# EAGLE design G17_Sensor_V2 (EAGLE 9.6.2)

## Sheet 1 of 4
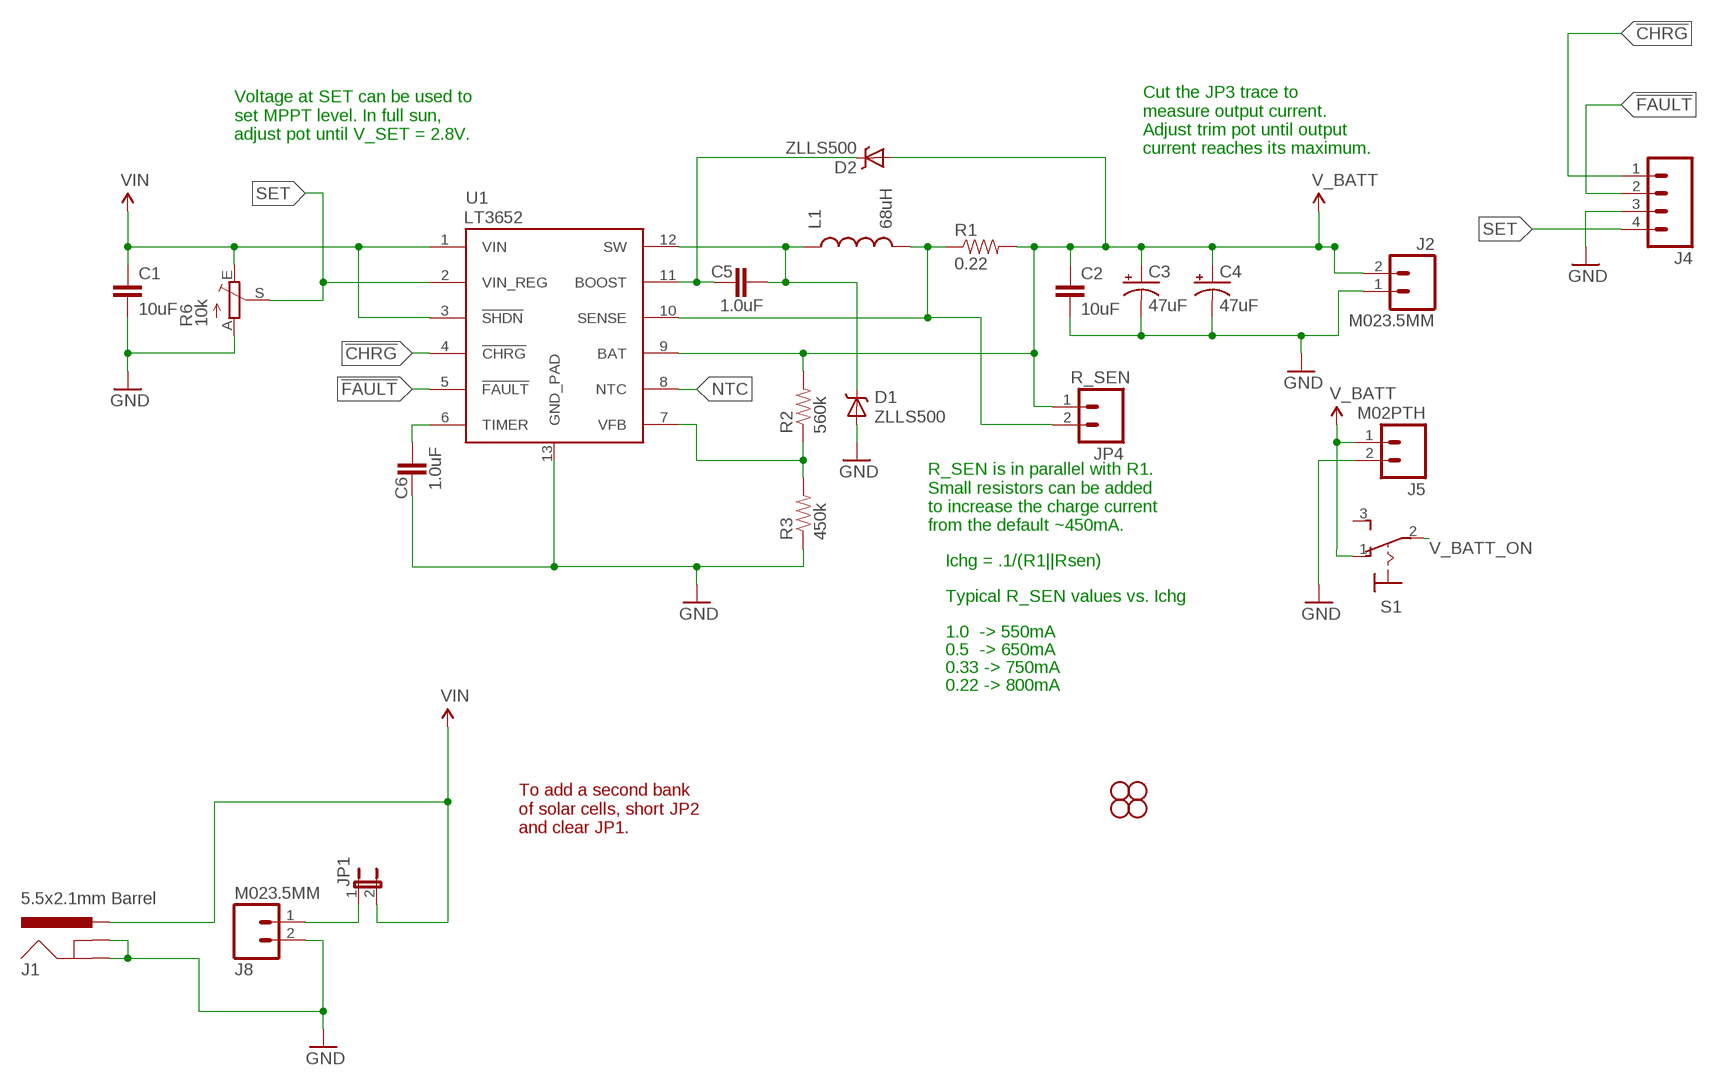
[diagram p0: schematic, sheet 1]

### Parts
C1  10uF  10UF50V20%(1210)  [1210]
C2  10uF  10UF-6.3V-20%(1206)  [1206]
C3  47uF  47UF-TANT  [EIA3528]
C4  47uF  47UF-TANT  [EIA3528]
C5  1.0uF  1.0UF-16V-10%(0603)  [0603-CAP]
C6  1.0uF  1.0UF-16V-10%(0603)  [0603-CAP]
D1  ZLLS500  ZLLS500ZLLS500  [SOT23]
D2  ZLLS500  ZLLS500ZLLS500  [SOT23]
J1  5.5x2.1mm Barrel  POWER_JACKSMD  [POWER_JACK_SMD]
J2  M023.5MM  [SCREWTERMINAL-3.5MM-2]
J4  M04PTH  [1X04]
J5  M02PTH  [1X02]
J8  M023.5MM  [SCREWTERMINAL-3.5MM-2]
JP1  JUMPER-2SMD-NC  [SJ_2S]
JP4  R_SEN  M02PTH  [1X02]
L1  68uH  INDUCTOR68UH-1A  [CR75]
R1  0.22  0.22OHM1/4W1%(0805)  [0805]
R2  560k  47KOHM1/10W1%(0603)  [0603-RES]
R3  450k  220KOHM1/10W1%(0603)  [0603-RES]
R6  10k  TRIM_EU-S63S  [S63S]
S1  M9040P  [M9040P]
STANDOFF1  STAND-OFF  [STAND-OFF]
STANDOFF2  STAND-OFF  [STAND-OFF]
STANDOFF3  STAND-OFF  [STAND-OFF]
STANDOFF4  STAND-OFF  [STAND-OFF]
U1  LT3652  [MSOP-12_GND]

### Nets
!CHRG: J4.1 U1.4(!CHRG)
!FAULT: J4.2 U1.5(!FAULT)
BOOST: C5.1 D2.3(C) U1.11(BOOST)
FB: R2.1 R3.2 U1.7(VFB)
GND: C1.2 C2.2 C3.C(-) C4.C(-) C6.1 D1.1(A) J1.GND(GNDBREAK) J1.P$4(GND) J2.1 J4.3 J5.2 J8.2 R3.1 R6.A U1.13(GND_PAD) ; also sheet 2
N$8: J8.1 JP1.1
NTC: U1.8(NTC)
SENSE: JP4.2 L1.P$2 R1.1 U1.10(SENSE)
SET: J4.4 R6.S U1.2(VIN_REG)
SW: C5.2 D1.3(C) L1.P$1 U1.12(SW)
TIMER: C6.2 U1.6(TIMER)
V_BATT: C2.1 C3.A(+) C4.A(+) D2.1(A) J2.2 J5.1 JP4.1 R1.2 R2.2 S1.1(O) U1.9(BAT)
V_BATT_ON: S1.2(P) ; also sheet 2
VIN: C1.1 J1.VIN0(PWR) JP1.2 R6.E U1.1(VIN) U1.3(!SHDN)
Unconnected: S1.3(S)

### Notes on the sheet
- Voltage at SET can be used to
  set MPPT level. In full sun,
  adjust pot until V_SET = 2.8V.
- Cut the JP3 trace to
  measure output current.
  Adjust trim pot until output
  current reaches its maximum.
- R_SEN is in parallel with R1.
  Small resistors can be added
  to increase the charge current
  from the default ~450mA.
- Ichg = .1/(R1||Rsen)
- Typical R_SEN values vs. Ichg
- 1.0  -> 550mA
- 0.5  -> 650mA
- 0.33 -> 750mA
- 0.22 -> 800mA
- To add a second bank
  of solar cells, short JP2
  and clear JP1.

## Sheet 2 of 4
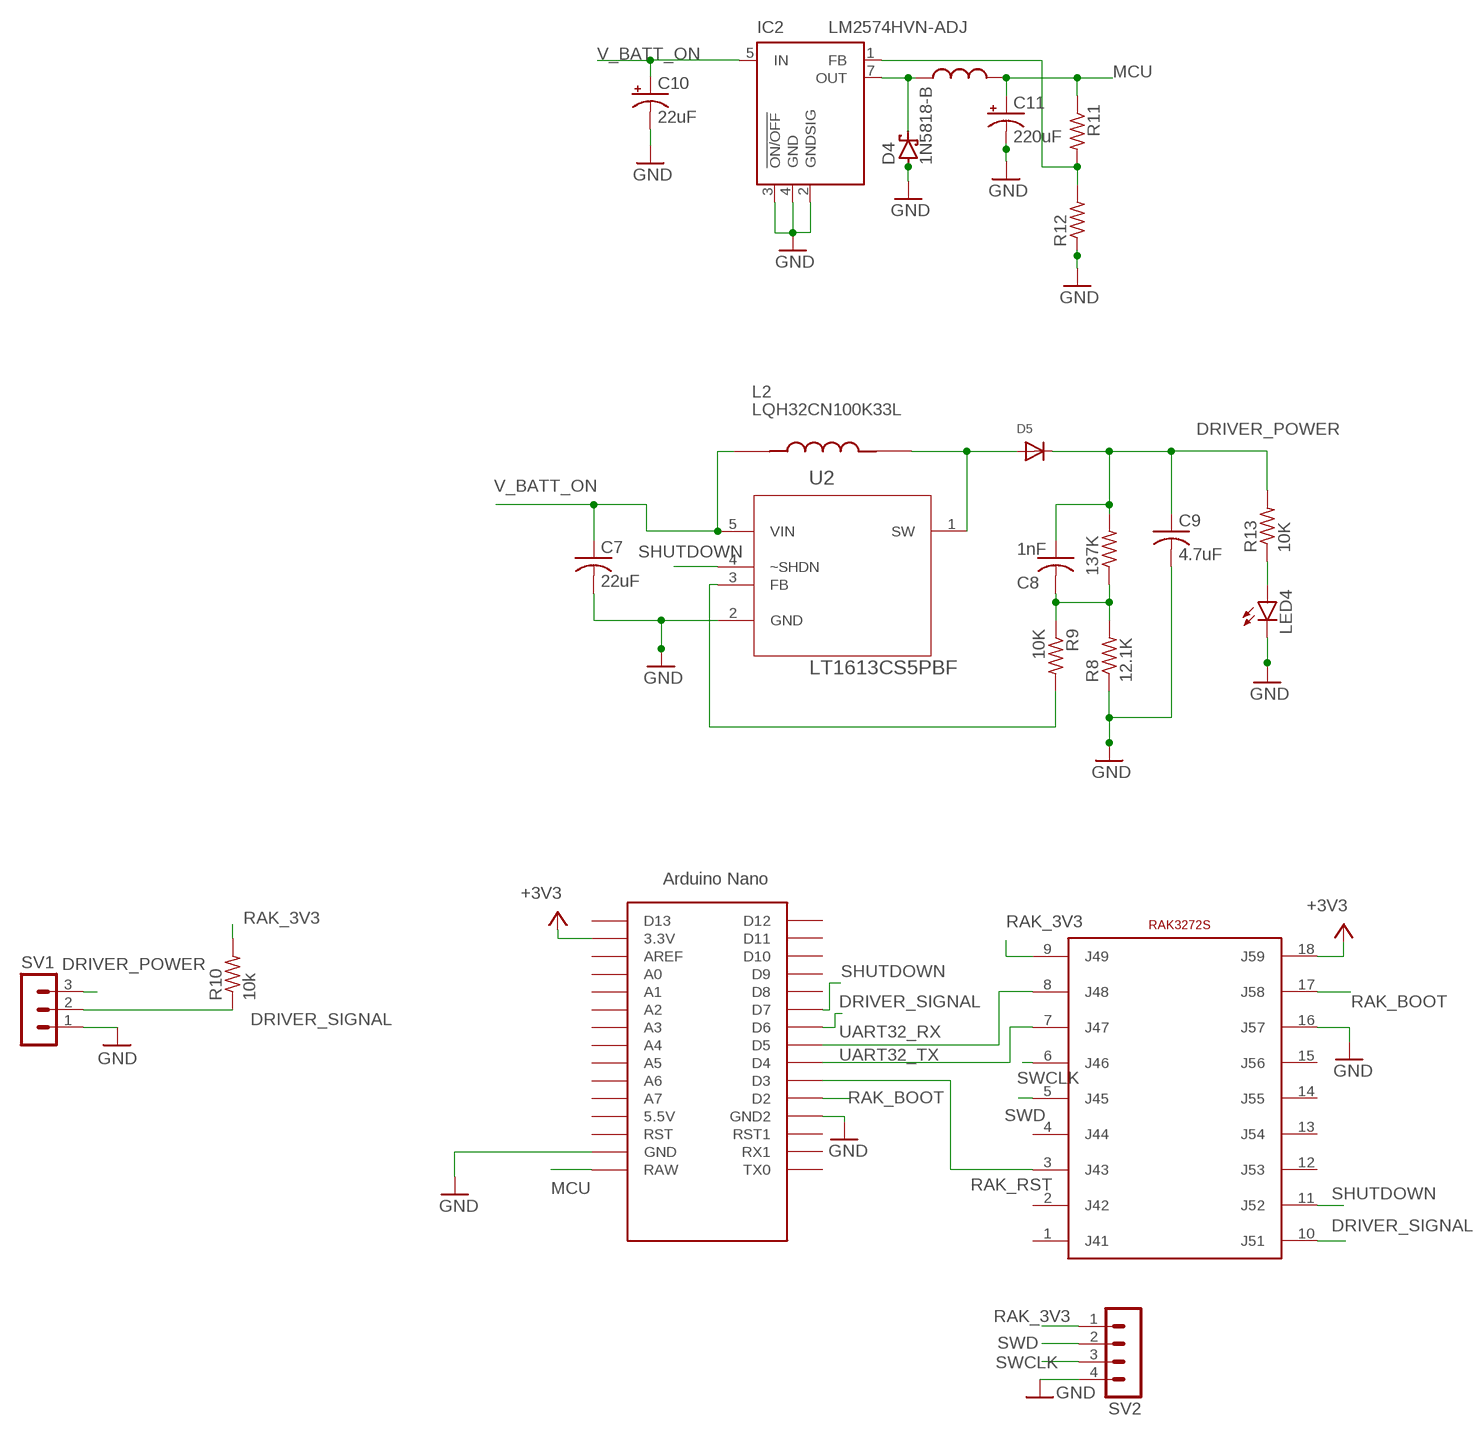
[diagram p1: schematic, sheet 2]

### Parts
137K  R-US_R0805  [R0805]
C7  22uF  C-USC0805  [C0805]
C8  1nF  C-USC0805  [C0805]
C9  4.7uF  C-USC1206  [C1206]
C10  22uF  CPOL-USE5-6  [E5-6]
C11  220uF  CPOL-USE5-6  [E5-6]
D4  1N5818-B  [DO41-7.6]
D5  DIODESOD-123  [SOD-123]
IC2  LM2574HVN-ADJ  [DIL08]
L2  LQH32CN100K33L  [IND_LQH32CN100K33L]
LED4  LED5MM  [LED5MM]
R8  12.1K  R-US_R1206  [R1206]
R9  10K  R-US_R0805  [R0805]
R10  10k  R-US_0204/5  [0204/5]
R11  R-US_0204/7  [0204/7]
R12  R-US_0204/7  [0204/7]
R13  10K  R-US_R0805  [R0805]
SV1  MA03-1  [MA03-1]
SV2  MA04-1  [MA04-1]
U2  LT1613CS5PBF  [SOT95P280X145-5N]
U$1  330UH_INDUCTOR  [330UH_INDUCTOR]
U$3  NANO  [NANO]
U$4  RAK3272S  [RAK3272SFOOTPRINT]

### Nets
+3V3: U$3.3.3V U$4.18(J59)
DRIVER_POWER: 137K.2 C8.1 C9.1 D5.C R13.2 SV1.3
DRIVER_SIGNAL: R10.1 SV1.2 U$3.D6 U$4.10(J51)
GND: C7.2 C9.2 C10.- C11.- D4.A IC2.2(GNDSIG) IC2.3(!ON/OFF) IC2.4(GND) LED4.K(C) R8.1 R12.1 SV1.1 SV2.4 U2.2(GND) U$3.GND U$3.GND1(GND2) U$4.16(J57) ; also sheet 1
MCU: C11.+ R11.1 U$1.P$2 U$3.RAW
N$5: IC2.1(FB) R11.2 R12.2
N$7: R9.2 U2.3(FB)
N$9: D5.A L2.2 U2.1(SW)
N$10: D4.C IC2.7(OUT) U$1.P$1
N$11: 137K.1 C8.2 R8.2 R9.1
N$12: LED4.A R13.1
RAK_3V3: R10.2 SV2.1 U$4.9(J49)
RAK_BOOT: U$3.D2 U$4.17(J58)
RAK_RST: U$3.D3 U$4.3(J43)
SHUTDOWN: U2.4(~SHDN) U$3.D7 U$4.11(J52)
SWCLK: SV2.3 U$4.6(J46)
SWD: SV2.2 U$4.5(J45)
UART32_RX: U$3.D5 U$4.8(J48)
UART32_TX: U$3.D4 U$4.7(J47)
V_BATT_ON: C7.1 C10.+ IC2.5(IN) L2.1 U2.5(VIN) ; also sheet 1
Unconnected: U$3.5V(5.5V) U$3.A0 U$3.A1 U$3.A2 U$3.A3 U$3.A4 U$3.A5 U$3.A6 U$3.A7 U$3.AREF U$3.D8 U$3.D9 U$3.D10 U$3.D11 U$3.D12 U$3.D13 U$3.ICSP1 U$3.ICSP2 U$3.ICSP3 U$3.ICSP4 U$3.ICSP5 U$3.ICSP6 U$3.RST U$3.RST1 U$3.RX1 U$3.TX0 U$4.1(J41) U$4.2(J42) U$4.4(J44) U$4.12(J53) U$4.13(J54) U$4.14(J55) U$4.15(J56)

## Sheet 3 of 4

## Sheet 4 of 4

## Library data of the parts
137K R8-R13 = rcl:R-US_: RESISTOR, American symbol; SPICEPREFIX: R
C1 = SparkFun-Capacitors:10UF50V20%(1210): CAP-09824; PROD_ID: CAP-09824
C2 = SparkFun-Capacitors:10UF-6.3V-20%(1206): Ceramic CAP-10057; PROD_ID: CAP-10057
C3 C4 = SparkFun-Capacitors:47UF-TANT: 47uF Tantalum SMT CAP-08310- 10V 10% (EIA-3528); PROD_ID: CAP-08310
C5 C6 = SparkFun-Capacitors:1.0UF-16V-10%(0603): CAP-00868; PROD_ID: CAP-00868
C7-C9 = rcl:C-US: CAPACITOR, American symbol; SPICEPREFIX: C
C10 C11 = rcl:CPOL-US: POLARIZED CAPACITOR, American symbol; SPICEPREFIX: C
D1 D2 = SparkFun-DiscreteSemi:ZLLS500: 700mA 40V SOT-23 Schottky; PROD_ID: DIO-08411
D4 = diode:1N581*: 1.0A SCHOTTKY BARRIER RECTIFIER Source: http://www.diodes.com/datasheets/ds23001.pdf
D5 = adafruit:DIODE: Diode SMADIODE - SMA Surface Mount Package 20V 1A Schottky Diode Digikey: 641-1014-6-ND DO-1N4148 - Through Hole Small Current Diode SOD-123 20V 1 A (.5mV Vf) Schottky Diode - Digikey: MBRX120TPMSCT-ND SOD-323 10V 570mA (.38mV Vf, 3ns) Schottky Diode - Digikey: ZLLS410CT-ND SOD-523 30V 30mA Schottky Diode (RB751S-40TE61) - Digikey: RB751S-40TE61CT-ND SOT23-R/W - SOT23 Package (R = Solder Paste/Reflow Ovens, W = Hand-Soldering) BAT54Film 40V 300mA - Digikey: 497-7162-1-ND
IC2 = linear:LM2574?-*: SIMPLE SWITCHER 0.5A Step-Down Voltage Regulator Source: http://cache.national.com/ds/LM/LM2574.pdf
J1 = SparkFun-Connectors:POWER_JACK: Power Jack This is the standard 5.5mm barrel jack for power. The PTH is the most common, proven, reliable, footprint. The Slot footprint only works if the mill layer is transmitted to the PCB fab house so be warned. Spark Fun Electronics SKU : PRT-00119 SMT: CONN-08106 Mating wall wart : TOL-00298 (and others); PROD_ID: CONN-08106
J2 J5 J8 JP4 = SparkFun-Connectors:M02: Standard 2-pin 0.1" header. Use with - straight break away headers ( PRT-00116) - right angle break away headers (PRT-00553) - swiss pins (PRT-00743) - machine pins (PRT-00117) - female headers (PRT-00115) Molex polarized connector foot print use with: PRT-08233 with associated crimp pins and housings. 2.54_SCREWTERM for use with PRT-10571. 3.5mm Screw Terminal footprints for PRT-08084 5mm Screw Terminal footprints for use with PRT-08433
J4 = SparkFun-Connectors:M04: Header 4 Standard 4-pin 0.1" header. Use with straight break away headers (SKU : PRT-00116), right angle break away headers (PRT-00553), swiss pins (PRT-00743), machine pins (PRT-00117), and female headers (PRT-00115). Molex polarized connector foot print use with SKU : PRT-08231 with associated crimp pins and housings. 1MM SMD Version SKU: PRT-10208
JP1 = SparkFun-Passives:JUMPER-2: Jumper Basic 0.1" spaced jumper. Use with breakaway headers.
L1 = SparkFun-Passives:INDUCTOR: Inductors Basic Inductor/Choke - 0603 and 1206. Footprints are not proven and vary greatly between part numbers. SRN6045- 33uH, 20% 1.4A SDR0403-560KL - 56uH, 10%, 500mA RMS/740mA peak; PROD_ID: NDUC-09739
L2 = LQH32CN100K33L:LQH32CN100K33L: Wire Wound Ferrite Inductor for Power Lines For Automotive Check availability <https://pricing.snapeda.com/parts/LQH32CN100K33L/Murata/view-part?ref=eda>; AVAILABILITY: In Stock; DESCRIPTION: Inductor with Inductance: 10uH Tol. +/-10%, Package: 1210 (3225); MF: Murata; MP: LQH32CN100K33L; PACKAGE: 1210-2 Murata; PRICE: None; PURCHASE-URL: https://pricing.snapeda.com/search/part/LQH32CN100K33L/?ref=eda
LED4 = led:LED: LED OSRAM: - CHIPLED LG R971, LG N971, LY N971, LG Q971, LY Q971, LO R971, LY R971 LH N974, LH R974 LS Q976, LO Q976, LY Q976 LO Q996 - Hyper CHIPLED LW Q18S LB Q993, LB Q99A, LB R99A - SideLED LS A670, LO A670, LY A670, LG A670, LP A670 LB A673, LV A673, LT A673, LW A673 LH A674 LY A675 LS A676, LA A676, LO A676, LY A676, LW A676 LS A679, LY A679, LG A679 - Hyper Micro SIDELED® LS Y876, LA Y876, LO Y876, LY Y876 LT Y87S - SmartLED LW L88C, LW L88S LB L89C, LB L89S, LG L890 LS L89K, LO L89K, LY L89K LS L896, LA L896, LO L896, LY L896 - TOPLED LS T670, LO T670, LY T670, LG T670, LP T670 LSG T670, LSP T670, LSY T670, LOP T670, LYG T670 LG T671, LOG T671, LSG T671 LB T673, LV T673, LT T673, LW T673 LH T674 LS T676, LA T676, LO T676, LY T676, LB T676, LH T676, LSB T676, LW T676 LB T67C, LV T67C, LT T67C, LS T67K, LO T67K, LY T67K, LW E67C LS E67B, LA E67B, LO E67B, LY E67B, LB E67C, LV E67C, LT E67C LW T67C LS T679, LY T679, LG T679 LS T770, LO T770, LY T770, LG T770, LP T770 LB T773, LV T773, LT T773, LW T773 LH T774 LS E675, LA E675, LY E675, LS T675 LS T776, LA T776, LO T776, LY T776, LB T776 LHGB T686 LT T68C, LB T68C - Hyper Mini TOPLED® LB M676 - Mini TOPLED Santana® LG M470 LS M47K, LO M47K, LY M47K Source: http://www.osram.convergy.de LUXEON: - LUMILED® LXK2-PW12-R00, LXK2-PW12-S00, LXK2-PW14-U00, LXK2-PW14-V00 LXK2-PM12-R00, LXK2-PM12-S00, LXK2-PM14-U00 LXK2-PE12-Q00, LXK2-PE12-R00, LXK2-PE12-S00, LXK2-PE14-T00, LXK2-PE14-U00 LXK2-PB12-K00, LXK2-PB12-L00, LXK2-PB12-M00, LXK2-PB14-N00, LXK2-PB14-P00, LXK2-PB14-Q00 LXK2-PR12-L00, LXK2-PR12-M00, LXK2-PR14-Q00, LXK2-PR14-R00 LXK2-PD12-Q00, LXK2-PD12-R00, LXK2-PD12-S00 LXK2-PH12-R00, LXK2-PH12-S00 LXK2-PL12-P00, LXK2-PL12-Q00, LXK2-PL12-R00 Source: www.luxeon.com KINGBRIGHT: KA-3528ASYC Source: www.kingbright.com
R1 = SparkFun-Resistors:0.22OHM1/4W1%(0805): RES-09883; PROD_ID: RES-09883
R2 = SparkFun-Resistors:47KOHM1/10W1%(0603): RES-07871; PROD_ID: RES-07871; VALUE: 47K
R3 = SparkFun-Resistors:220KOHM1/10W1%(0603): RES-08969; PROD_ID: RES-08969; VALUE: 220k
R6 = pot:TRIM_EU-: POTENTIOMETER
S1 = switch:M9040P: TOGGLE SWITCH Marquardt
STANDOFF1-STANDOFF4 = SparkFun-Electromechanical:STAND-OFF: #4 Stand Off This is the mechanical footprint for a #4 phillips button head screw. Use the keepout ring to avoid running the screw head into surrounding components. SKU : PRT-00447
SV1 = con-lstb:MA03-1: PIN HEADER; OC_FARNELL: unknown; OC_NEWARK: unknown
SV2 = con-lstb:MA04-1: PIN HEADER; OC_FARNELL: unknown; OC_NEWARK: unknown
U1 = SparkFun-PowerIC:LT3652: LT3652 MPPT Solar Charge Controller 5V-32V smart charger for batteries up to 14.4V
U2 = LTC_By_element14_Batch_1:LT1613CS5PBF: DC/DC Converter; MPN: LT1613CS5#PBF; OC_FARNELL: 1531483; OC_NEWARK: 61M3347; PACKAGE: SOT-23-5; SUPPLIER: Linear Technology
U$1 = ece490capestone:330UH_INDUCTOR
U$3 = Arduino-clone:NANO: Arduino Nano
U$4 = ece490capestone:RAK3272S

## Board
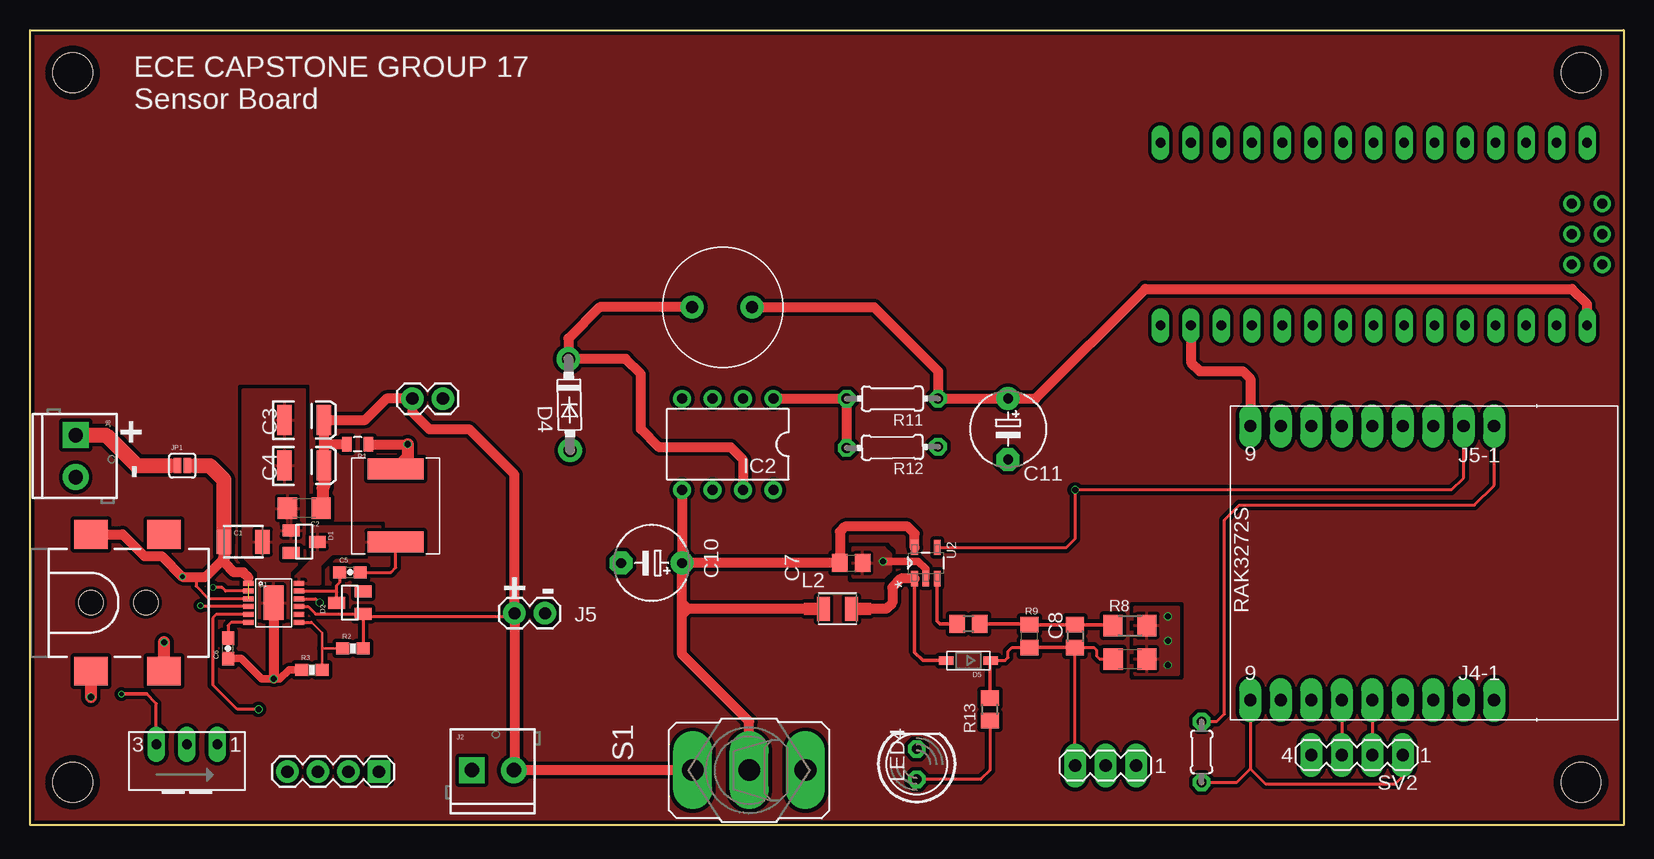
[diagram p2: board, top side]
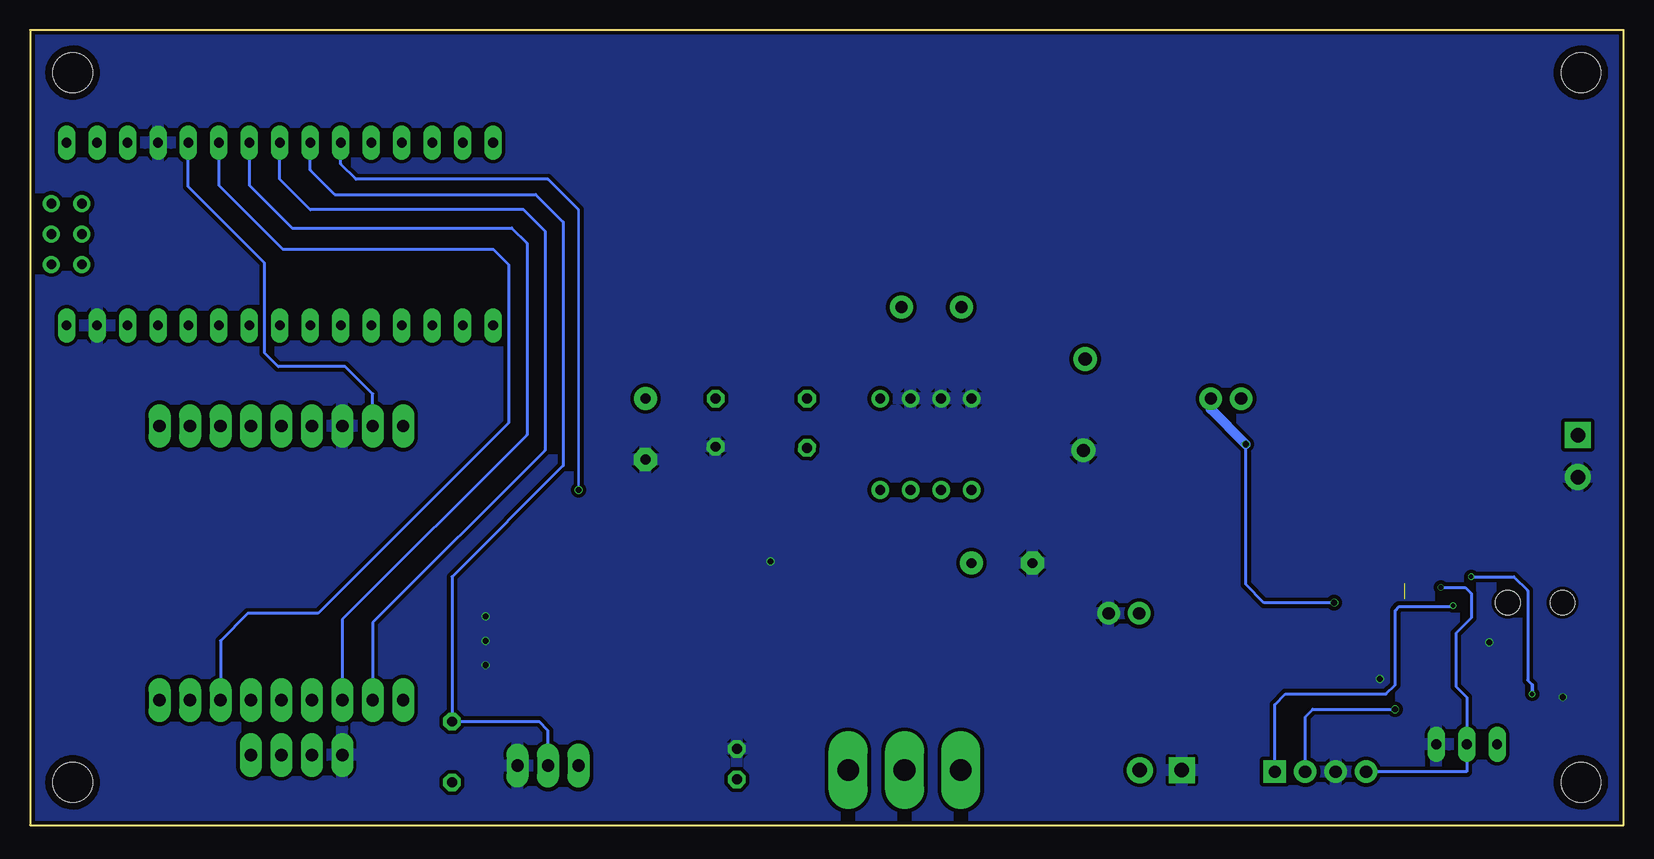
[diagram p3: board, bottom side, seen from below]

Size 132.84 x 66.29 mm. Coordinates in mm from the lower left corner, seen from the top.
Outline: 0,66.29 132.84,66.29 132.84,0 0,0 0,66.29
Copper layers (1*16): Top 0.035mm / dielectric 1.6mm / Bottom 0.035mm
Design rules "jlcpcb-2layers": minimum track width 5mil, minimum drill 0.3mm, track to track 5mil, track to pad 5mil, pad to pad 5mil, via to via 5mil, smd to smd 5mil, copper to edge 0.2mm, drill to drill 6mil, minimum pad ring 10mil, minimum via ring 3mil, stop-mask expansion 4mil, vias tented up to drill 0mil, thermal gap 10mil

### Footprints (pad centres in the part's own frame; a part is rotated, then mirrored left to right if it is on the bottom)
R0805 = smd 1.3 x 1.5: 1 -0.95,0; 2 0.95,0
1210 = smd 1.2 x 2: 1 -1.6,0; 2 1.6,0
1206 = smd 1.6 x 1.8: 1 -1.4,0; 2 1.4,0
EIA3528 = smd 1.2 x 2.5: A 1.65,0; C -1.65,0
0603-CAP = smd 1.1 x 1: 1 -0.85,0; 2 0.85,0
C0805 = smd 1.3 x 1.5: 1 -0.95,0; 2 0.95,0
C1206 = smd 1.6 x 1.8: 1 -1.4,0; 2 1.4,0
E5-6 = drill 0.813 pad 1.905: + -2.54,0 | drill 0.813 pad 1.905 octagon: - 2.54,0
SOT23 = smd 1 x 1.4: 1 -0.95,-1.1; 2 0.95,-1.1; 3 0,1.1
DO41-7.6 = drill 1.1 pad 1.7: A 3.81,0; C -3.81,0
SOD-123 = smd 1.2 x 0.7: A 1.85,0; C -1.85,0
DIL08 = drill 0.813 pad 1.27: 1 -3.81,-3.81; 2 -1.27,-3.81; 3 1.27,-3.81; 4 3.81,-3.81; 5 3.81,3.81; 6 1.27,3.81; 7 -1.27,3.81; 8 -3.81,3.81
POWER_JACK_SMD = smd 2.8 x 2.4: GND 0,-5.7; P$4 6.1,-5.7; VIN0 0,5.7; VIN1 6.1,5.7 | hole 2.032: 0,0; 4.572,0
SCREWTERMINAL-3.5MM-2 = drill 1.2 pad 2.032 square: 1 0,0 | drill 1.2 pad 2.032: 2 3.5,0
1X04 = drill 1.016 pad 1.88 square: 1 0,0 | drill 1.016 pad 1.88: 2 2.54,0; 3 5.08,0; 4 7.62,0
1X02 = drill 1.016 pad 1.88: 1 0,0; 2 2.54,0
SJ_2S = smd 0.635 x 1.27: 1 -0.412,0; 2 0.412,0
CR75 = smd 1.75 x 4.7: P$1 0,0; P$2 6.05,0
IND_LQH32CN100K33L = smd 1 x 2: 1 -1.15,0; 2 1.15,0
LED5MM = drill 0.813 octagon: A -1.27,0; K 1.27,0
0805 = smd 0.8 x 1.2: 1 -0.9,0; 2 0.9,0
0603-RES = smd 1.1 x 1: 1 -0.85,0; 2 0.85,0
S63S = drill 0.813 long: A 2.54,1.27; E -2.54,1.27; S 0,1.27
R1206 = smd 1.6 x 1.803: 1 -1.422,0; 2 1.422,0
0204/5 = drill 0.813 octagon: 1 -2.54,0; 2 2.54,0
0204/7 = drill 0.813 octagon: 1 -3.81,0; 2 3.81,0
M9040P = drill 1.803 long: 1 0,4.699; 2 0,0; 3 0,-4.699
STAND-OFF = hole 3.302: 0,0
MA03-1 = drill 1.016 long: 1 -2.54,0; 2 0,0; 3 2.54,0
MA04-1 = drill 1.016 long: 1 -3.81,0; 2 -1.27,0; 3 1.27,0; 4 3.81,0
MSOP-12_GND = smd 0.889 x 0.42: 1 -2.1,1.625; 2 -2.1,0.975; 3 -2.1,0.325; 4 -2.1,-0.325; 5 -2.1,-0.975; 6 -2.1,-1.625; 7 2.1,-1.625; 8 2.1,-0.975; 9 2.1,-0.325; 10 2.1,0.325; 11 2.1,0.975; 12 2.1,1.625 | smd 1.651 x 2.845: 13 0,0
SOT95P280X145-5N = smd 1.27 x 0.559: 1 -1.295,0.94; 2 -1.295,0; 3 -1.295,-0.94; 4 1.295,-0.94; 5 1.295,0.94
330UH_INDUCTOR = drill 1.016 pad 1.93: P$1 -5,0; P$2 0,0
NANO = drill 0.8 long: 3.3V -10.16,24.13; 5V -10.16,-1.27; A0 -10.16,19.05; A1 -10.16,16.51; A2 -10.16,13.97; A3 -10.16,11.43; A4 -10.16,8.89; A5 -10.16,6.35; A6 -10.16,3.81; A7 -10.16,1.27; AREF -10.16,21.59; D2 5.08,1.27; D3 5.08,3.81; D4 5.08,6.35; D5 5.08,8.89; D6 5.08,11.43; D7 5.08,13.97; D8 5.08,16.51; D9 5.08,19.05; D10 5.08,21.59; D11 5.08,24.13; D12 5.08,26.67; D13 -10.16,26.67; GND -10.16,-6.35; GND1 5.08,-1.27; RAW -10.16,-8.89; RST -10.16,-3.81; RST1 5.08,-3.81; RX1 5.08,-6.35; TX0 5.08,-8.89 | drill 0.8: ICSP1 -5.08,-10.16; ICSP2 -5.08,-7.62; ICSP3 -2.54,-10.16; ICSP4 -2.54,-7.62; ICSP5 0,-10.16; ICSP6 0,-7.62
RAK3272SFOOTPRINT = drill 1.016 long: 1 11.43,10.16; 2 11.43,7.62; 3 11.43,5.08; 4 11.43,2.54; 5 11.43,0; 6 11.43,-2.54; 7 11.43,-5.08; 8 11.43,-7.62; 9 11.43,-10.16; 10 -11.43,10.16; 11 -11.43,7.62; 12 -11.43,5.08; 13 -11.43,2.54; 14 -11.43,0; 15 -11.43,-2.54; 16 -11.43,-5.08; 17 -11.43,-7.62; 18 -11.43,-10.16

### Placement (x,y rotation side)
137K  87.12,15.75 270 top
C1  17.78,23.62 0 top
C2  22.86,26.42 180 top
C3  22.86,33.78 0 top
C4  22.86,29.97 0 top
C5  26.67,21.08 0 top
C6  16.51,14.73 90 top
C7  68.45,21.84 0 top
C8  83.31,15.75 90 top
C9  91.69,13.84 0 top
C10  51.82,21.84 180 top
C11  81.53,33.02 270 top
D1  22.86,23.62 270 top
D2  26.67,18.54 90 top
D4  44.96,35.05 271.1 top
D5  78.23,13.72 180 top
IC2  58.17,31.75 180 top
J1  5.08,18.54 0 top
J2  36.83,4.57 0 top
J4  29.08,4.45 180 top
J5  40.39,17.65 0 top
J8  3.81,32.51 270 top
JP1  12.7,29.97 0 top
JP4  31.88,35.56 0 top
L1  30.48,23.62 90 top
L2  67.31,18.03 0 top
LED4  73.91,5.08 90 top
R1  27.3,31.75 180 top
R2  26.92,14.73 0 top
R3  23.5,12.95 0 top
R6  13.08,5.46 0 top
R8  91.69,16.64 180 top
R9  78.23,16.76 180 top
R10  97.66,6.1 270 top
R11  71.88,35.56 180 top
R12  71.88,31.5 180.8 top
R13  80.01,9.65 90 top
S1  59.94,4.57 90 top
STANDOFF1  3.56,3.56 0 top
STANDOFF2  3.56,62.74 0 top
STANDOFF3  129.29,62.74 0 top
STANDOFF4  129.29,3.56 0 top
SV1  89.66,4.95 180 top
SV2  110.62,5.84 180 top
U1  20.32,18.54 0 top
U2  74.68,21.84 90 top
U$1  60.2,43.18 0 top
U$3  120.9,51.82 90 top
U$4  111.89,21.84 270 top

### Tracks (layer width: path | path; a pad name or v marks a point on that pad's centre or on a via)
!CHRG  (via drill 0.38)
  Top 0.254: U1.4 14.29,18.22 v14.22,18.29
  Bottom 0.254: v14.22,18.29 14.29,18.22 18.73,18.22 19.05,17.89 19.05,11.68 19.81,10.92 28.19,10.92 29.08,10.03 J4.1
!FAULT  (via drill 0.51)
  Top 0.254: U1.5 15.54,17.57 15.24,17.27 15.24,11.68 17.27,9.65 v19.05,9.65
  Bottom 0.254: J4.2 26.54,9.02 25.91,9.65 v19.05,9.65
+3V3
  Top 0.813: U$3.3.3V 96.77,38.58 97.51,37.85 101.09,37.85 101.73,37.21 U$4.18
BOOST
  Top 0.254: D2.3 25.57,19.43 | 25.57,19.43 25.57,19.98 25.82,20.23 C5.1 | U1.11 25.48,19.52 25.57,19.43
DRIVER_POWER
  Top 0.254: SV1.3 137K.2 88.71,14.8 88.9,14.61 88.9,14.1 89.15,13.84 C9.1 | D5.C 81.28,13.72 81.53,13.97 81.53,14.48 81.85,14.8 C8.1
  Top 0.305: C8.1 137K.2 | D5.C 80.01,13.64 R13.2
DRIVER_SIGNAL
  Top 0.254: U$4.10 122.05,28.32 120.4,26.67 100.81,26.67 99.57,25.43 99.57,9.27 98.93,8.64 R10.1
  Bottom 0.254: SV1.2 89.66,7.87 90.42,8.64 R10.1 97.66,20.7 88.39,29.97 88.39,50.29 90.68,52.58 107.44,52.58 109.47,54.61 U$3.D6
FB
  Top 0.203: 23.47,16.92 24.34,16.04 24.34,14.73 | 24.34,14.73 R3.2 | R2.1 24.34,14.73
  Top 0.254: U1.7 23.47,16.92
GND  (via drill 0.51)
  Top 0.61: U2.2 74.68,21.34 74.04,21.97 v71.12,21.97 | R3.1 21.59,12.95 20.83,12.19 v20.32,12.19 19.3,12.19 17.61,13.88 C6.1
  Top 0.813: U1.13 v20.32,12.19
  Top 1.016: J1.P$4 v11.18,15.24 | J1.GND v5.08,10.67
  other vias: 94.87,17.4 94.87,13.34 94.87,15.37
  pour Top (isolate 0.305): 22.86,36.32 22.86,22.35 21.59,21.08 21.59,17.27 19.05,17.27 19.05,21.08 17.78,22.35 17.78,36.32
  pour Bottom (isolate 0.305): 132.33,0.51 0.76,0.51 0.76,65.53 132.33,65.53
  pour Top: 92.08,18.16 92.08,12.57 95.76,12.57 95.76,18.16
  pour Top: 68.58,23.11 68.58,20.7 71.25,20.7 71.75,21.21 71.75,22.61 71.25,23.11
MCU
  Top 0.813: U$1.P$2 70.36,43.18 75.69,37.85 R11.1 C11.+ 83.82,35.56 92.96,44.7 128.52,44.7 129.79,43.43 U$3.RAW
N$1
  pour Top (isolate 0.305, rank 2, no thermals): 0,66.29 132.84,66.29 132.84,0 0,0
N$5
  Top 0.813: IC2.1 R11.2 R12.2 | R12.2
N$7
  Top 0.305: U2.3 75.62,17.02 75.87,16.76 R9.2
N$8
  Top 0.254: JP1.1 11.68,29.97
  Top 1.27: J8.1 6.35,32.51 8.89,29.97 11.68,29.97
N$9
  Top 0.305: D5.A 74.42,13.72 73.74,14.4 U2.1 | 69.6,18.03 L2.2
  Top 0.813: 69.6,18.03 71.37,18.03 71.88,18.54 71.88,19.81 72.62,20.55 U2.1
N$10
  Top 0.813: U$1.P$1 47.5,43.18 44.88,40.57 D4.C 46.23,38.86 49.66,38.86 50.93,37.59 50.93,33.02 52.45,31.5 58.42,31.5 59.44,30.48 IC2.7
N$11
  Top 0.305: R9.1 83.14,16.76 C8.2 137K.1 90.21,16.7 R8.2
N$12
  Top 0.254: R13.1 80.01,4.57 79.25,3.81 LED4.A
RAK_3V3
  Top 0.254: U$4.9 101.73,4.7 | 101.73,4.7 103,3.43 113.79,3.43 114.43,4.06 SV2.1 | R10.2 100.58,3.56 101.73,4.7
RAK_BOOT
  Bottom 0.254: U$4.17 104.27,35.94 106.55,38.23 112.14,38.23 113.28,39.37 113.28,46.86 119.63,53.21 U$3.D2
RAK_RST
  Bottom 0.254: U$3.D3 117.09,53.34 111.76,48.01 94.23,48.01 92.96,46.74 92.96,33.53 108.84,17.65 114.68,17.65 116.97,15.37 U$4.3
SENSE  (via drill 0.51)
  Top 0.254: U1.10 23.8,18.87 v24.13,18.54
  Top 0.813: R1.1 v31.5,31.75
  Top 1.016: v31.5,31.75 31.5,30.69 L1.P$2
  Bottom 0.254: v24.13,18.54 29.97,18.54 31.5,20.07 v31.5,31.75
  Bottom 0.813: JP4.2 34.42,34.67 v31.5,31.75
SET  (via drill 0.38)
  Top 0.254: U1.2 16.3,19.52 16,19.81 v15.24,19.81
  Bottom 0.254: v15.24,19.81 13.21,19.81 12.7,19.3 12.7,17.27 13.97,16 13.97,11.56 13.08,10.67 R6.S 13.08,4.45 J4.4
SHUTDOWN  (via drill 0.51)
  Top 0.254: U2.4 75.64,23.11 86.36,23.11 87.12,23.88 v87.12,27.94 118.49,27.94 119.51,28.96 U$4.11
  Bottom 0.203: 87.12,51.31 v87.12,27.94
  Bottom 0.254: 87.12,51.31 89.66,53.85 105.66,53.85 106.93,55.12 U$3.D7
SW
  Top 0.254: C5.2 30.1,21.08 30.48,21.46 L1.P$1
  pour Top (isolate 0.305): 23.5,24.89 29.21,24.89 29.21,22.73 29.08,22.61 25.15,22.61 24.13,21.59 24.13,20.07 22.1,20.07 22.1,20.7 23.5,22.1
SWCLK
  Top 0.254: U$4.6 SV2.3
SWD
  Top 0.254: U$4.5 SV2.2
TIMER
  Top 0.254: U1.6 16.79,16.92 16.51,16.64 C6.2
UART32_RX
  Bottom 0.254: U$3.D5 112.01,53.85 109.47,51.31 91.69,51.31 89.92,49.53 89.92,31.24 104.27,16.89 U$4.8
UART32_TX
  Bottom 0.254: U$3.D4 114.55,53.34 111,49.78 92.69,49.78 91.42,48.51 91.42,32.53 106.81,17.14 U$4.7
V_BATT
  Top 0.254: U1.9 23.18,18.22 23.81,17.59 D2.1 | D2.1 R2.2 | D2.1 28.02,17.34 40.07,17.34 J5.1
  Top 0.813: S1.1 J2.2 40.39,4.52 J5.1 40.39,29.23 36.6,33.02 33.27,33.02 31.88,34.42 JP4.1 29.72,35.56 27.94,33.78 C3.A 24.51,31.75 | C4.A 24.51,31.75 | R1.2 24.51,31.75
  Top 1.016: C4.A 24.51,28.19 24.38,28.07 24.38,26.54 C2.1
V_BATT_ON
  Top 0.813: S1.2 59.94,8.64 54.36,14.22 54.36,17.53 | IC2.5 C10.+ | 54.36,17.53 54.36,18.54 | 54.36,18.54 C10.+ | U2.5 73.74,24.31 73.15,24.89 67.94,24.89 67.5,24.45 C7.1 C10.+ | L2.1 54.86,18.03 | 54.86,18.03 54.36,17.53 | 54.86,18.03 54.36,18.54
VIN  (via drill 0.38)  (1 unrouted)
  Top 0.254: 13.73,29.96 13.72,29.97 JP1.2 | U1.3 14.91,18.87 13.84,19.94 13.84,20.7 v12.7,20.7 | 9.73,10.92 10.54,10.11 R6.E
  Top 0.305: 9.73,10.92 v7.62,10.92
  Top 0.406: 18.22,20.64 U1.1
  Top 0.813: J1.VIN0 7.72,24.24 9.53,22.43 10.97,22.43 v12.7,20.7 14.64,20.7 16.18,22.24 | 18.22,20.64 17.78,21.08 17.02,21.08 16.18,21.92
  Top 1.016: C1.1 16.18,22.24
  Top 1.27: C1.1 16.18,28.78 15,29.96 13.73,29.96
  Bottom 0.254: 7.62,11.68 8,12.07 8,19.56 9.14,20.7 v12.7,20.7
  Bottom 0.305: v7.62,10.92 7.62,11.68

### Text on the board
tPlace: + | - | - | +
tNames: ECE CAPSTONE GROUP 17 / Sensor Board